# Altium schematic sheet JTAG.SchDoc
size A
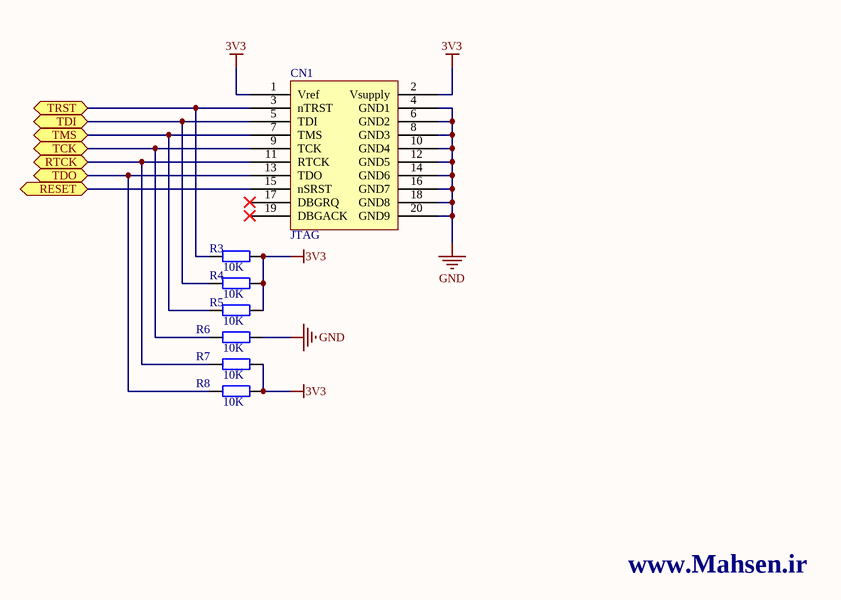
[diagram p0: JTAG.SchDoc]

## Parts
CN1  JTAG  [FKV20SN]
R3  10K  [0805]
R4  10K  [0805]
R5  10K  [0805]
R6  10K  [0805]
R7  10K  [0805]
R8  10K  [0805]

## Ports
RESET (bidir), RTCK (bidir), TCK (bidir), TDI (bidir), TDO (bidir), TMS (bidir), TRST (bidir)

## Nets
3V3: CN1.1(Vref) CN1.2(Vsupply) R3.1 R4.1 R5.1 R7.1 R8.1
GND: CN1.4(GND1) CN1.6(GND2) CN1.8(GND3) CN1.10(GND4) CN1.12(GND5) CN1.14(GND6) CN1.16(GND7) CN1.18(GND8) CN1.20(GND9) R6.1
RESET: CN1.15(nSRST) ; port RESET
RTCK: CN1.11(RTCK) R7.2 ; port RTCK
TCK: CN1.9(TCK) R6.2 ; port TCK
TDI: CN1.5(TDI) R4.2 ; port TDI
TDO: CN1.13(TDO) R8.2 ; port TDO
TMS: CN1.7(TMS) R5.2 ; port TMS
TRST: CN1.3(nTRST) R3.2 ; port TRST

Not connected (* = marked no-connect by the designer): CN1 17(DBGRQ)* 19(DBGACK)*

## Notes on the sheet
- www.Mahsen.ir

## Library data of the parts
R3-R8 = Res2: Resistor; Published: 8-Jun-2000; LatestRevisionDate: 17-Jul-2002; LatestRevisionNote: Re-released for DXP Platform.; PackageReference: AXIAL-0.4; Publisher: Altium Limited; PackageDescription: Axial Device, Thru-Hole; 2 Leads; 0.4 in Pin Spacing; Value: 10K